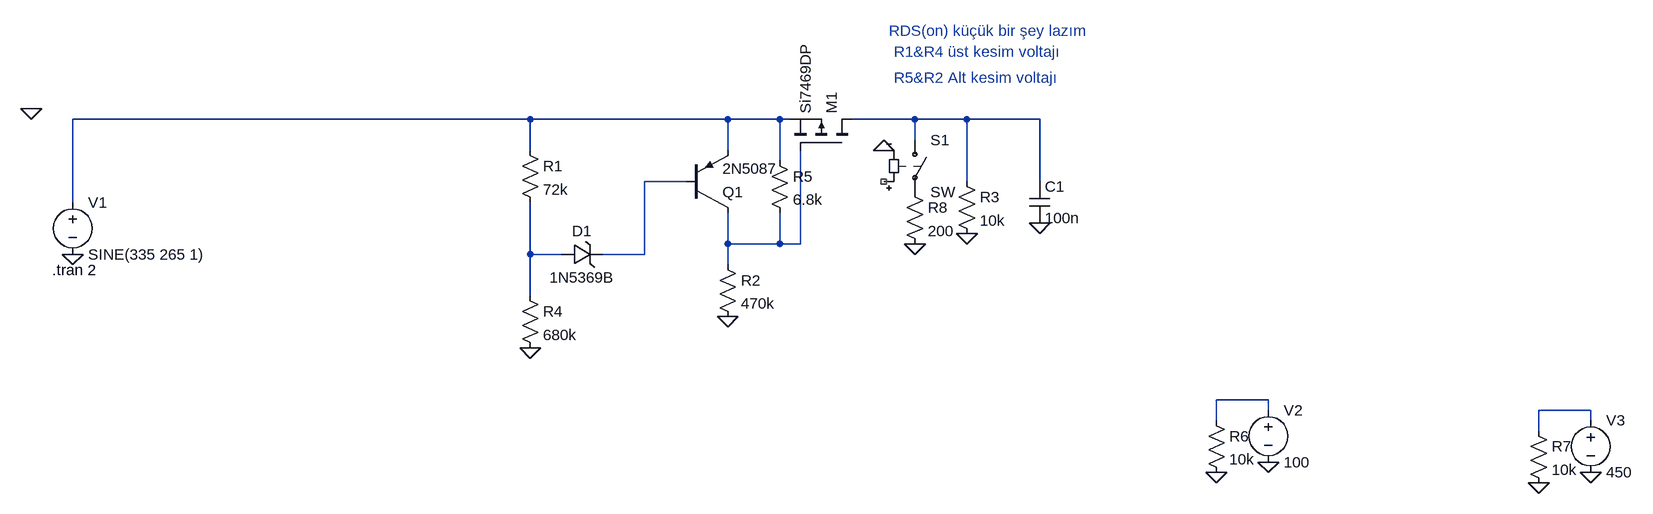
[diagram p0: schematic voltage_protection.asc]
voltage_protection.asc, the LTspice schematic file:
Version 4
SHEET 1 2472 680
WIRE 768 16 64 16
WIRE 1072 16 768 16
WIRE 1152 16 1072 16
WIRE 1168 16 1152 16
WIRE 1360 16 1264 16
WIRE 1440 16 1360 16
WIRE 1552 16 1440 16
WIRE 1360 48 1360 16
WIRE 768 64 768 16
WIRE 1072 64 1072 16
WIRE 1152 80 1152 16
WIRE 1008 112 944 112
WIRE 1440 112 1440 16
WIRE 1552 112 1552 16
WIRE 64 144 64 16
WIRE 1072 208 1072 160
WIRE 1152 208 1152 160
WIRE 1152 208 1072 208
WIRE 1184 208 1184 64
WIRE 1184 208 1152 208
WIRE 768 224 768 144
WIRE 816 224 768 224
WIRE 944 224 944 112
WIRE 944 224 880 224
WIRE 1072 240 1072 208
WIRE 768 288 768 224
WIRE 1904 448 1824 448
WIRE 1904 464 1904 448
WIRE 2400 464 2320 464
WIRE 1824 480 1824 448
WIRE 2400 480 2400 464
WIRE 2320 496 2320 464
FLAG 64 224 0
FLAG 1440 192 0
FLAG 768 368 0
FLAG 1072 320 0
FLAG 1904 544 0
FLAG 1824 560 0
FLAG 2400 560 0
FLAG 2320 576 0
FLAG 1552 176 0
FLAG 1360 208 0
FLAG 1312 64 0
FLAG 0 0 0
SYMBOL voltage 64 128 R0
WINDOW 123 0 0 Left 0
WINDOW 39 0 0 Left 0
SYMATTR InstName V1
SYMATTR Value SINE(335 265 1)
SYMBOL res 752 48 R0
SYMATTR InstName R1
SYMATTR Value 72k
SYMBOL res 1424 96 R0
SYMATTR InstName R3
SYMATTR Value 10k
SYMBOL res 752 272 R0
SYMATTR InstName R4
SYMATTR Value 680k
SYMBOL pmos 1264 64 M270
SYMATTR InstName M1
SYMATTR Value Si7469DP
SYMBOL pnp 1008 160 M180
SYMATTR InstName Q1
SYMATTR Value 2N5087
SYMBOL res 1056 224 R0
SYMATTR InstName R2
SYMATTR Value 470k
SYMBOL zener 816 240 R270
WINDOW 0 36 32 VTop 2
WINDOW 3 -4 32 VBottom 2
SYMATTR InstName D1
SYMATTR Value 1N5369B
SYMBOL res 1136 64 R0
SYMATTR InstName R5
SYMATTR Value 6.8k
SYMBOL voltage 1904 448 R0
WINDOW 123 0 0 Left 0
WINDOW 39 0 0 Left 0
SYMATTR InstName V2
SYMATTR Value 100
SYMBOL res 1808 464 R0
SYMATTR InstName R6
SYMATTR Value 10k
SYMBOL voltage 2400 464 R0
WINDOW 123 0 0 Left 0
WINDOW 39 0 0 Left 0
SYMATTR InstName V3
SYMATTR Value 450
SYMBOL res 2304 480 R0
SYMATTR InstName R7
SYMATTR Value 10k
SYMBOL cap 1536 112 R0
SYMATTR InstName C1
SYMATTR Value 100n
SYMBOL sw 1360 32 R0
SYMATTR InstName S1
SYMBOL res 1344 112 R0
SYMATTR InstName R8
SYMATTR Value 200
TEXT 32 248 Left 2 !.tran 2
TEXT 1320 -120 Left 2 ;RDS(on) küçük bir şey lazım
TEXT 1328 -88 Left 2 ;R1&R4 üst kesim voltajı
TEXT 1328 -48 Left 2 ;R5&R2 Alt kesim voltajı

The netlist it stands for:
* voltage_protection.asc
V1 N001 0 SINE(335 265 1)
R1 N001 N005 72k
R3 N002 0 10k
R4 N005 0 680k
M1 N002 N004 N001 N001 Si7469DP
Q1 N004 N003 N001 0 2N5087
R2 N004 0 470k
D1 N005 N003 1N5369B
R5 N001 N004 6.8k
V2 N006 0 100
R6 N006 0 10k
V3 N007 0 450
R7 N007 0 10k
C1 N002 0 100n
S1 N002 P001 NC_01 0 SW
R8 P001 0 200
.model D D
.lib standard.dio
.model NPN NPN
.model PNP PNP
.lib standard.bjt
.model NMOS NMOS
.model PMOS PMOS
.lib standard.mos
.tran 2
* RDS(on) küçük bir şey lazım
* R1&R4 üst kesim voltajı
* R5&R2 Alt kesim voltajı
.backanno
.end